# Altium schematic sheet ISEGYE_IDOL.SchDoc
size A4
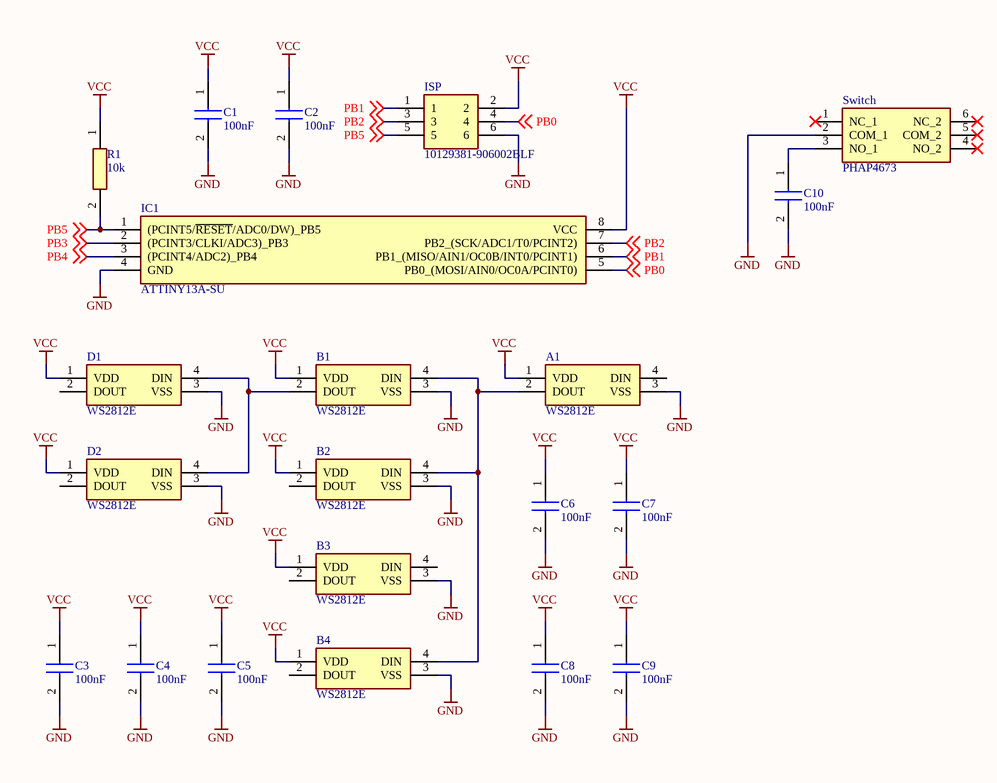
[diagram p0: ISEGYE_IDOL.SchDoc]

## Parts
A1  WS2812E  [WS2812E]
B1  WS2812E  [WS2812E]
B2  WS2812E  [WS2812E]
B3  WS2812E  [WS2812E]
B4  WS2812E  [WS2812E]
C1  100nF  [CAPC2012X94N]
C2  100nF  [CAPC2012X94N]
C3  100nF  [CAPC2012X94N]
C4  100nF  [CAPC2012X94N]
C5  100nF  [CAPC2012X94N]
C6  100nF  [CAPC2012X94N]
C7  100nF  [CAPC2012X94N]
C8  100nF  [CAPC2012X94N]
C9  100nF  [CAPC2012X94N]
C10  100nF  [CAPC2012X94N]
D1  WS2812E  [WS2812E]
D2  WS2812E  [WS2812E]
IC1  ATTINY13A-SU  [SOIC127P798X216-8N]
ISP  10129381-906002BLF  [HDRV6W67P254_2X3_762X483X858P]
R1  10k  [RESC2012X65N]
Switch  PHAP4673  [PHAP4673]

## Nets
GND: A1.3(VSS) B1.3(VSS) B2.3(VSS) B3.3(VSS) B4.3(VSS) C1.2 C2.2 C3.2 C4.2 C5.2 C6.2 C7.2 C8.2 C9.2 C10.2 D1.3(VSS) D2.3(VSS) IC1.4(GND) ISP.6 Switch.2(COM_1)
VCC: A1.1(VDD) B1.1(VDD) B2.1(VDD) B3.1(VDD) B4.1(VDD) C1.1 C2.1 C3.1 C4.1 C5.1 C6.1 C7.1 C8.1 C9.1 D1.1(VDD) D2.1(VDD) IC1.8(VCC) ISP.2 R1.1
PB0: IC1.5(PB0_(MOSI/AIN0/OC0A/PCINT0)) ISP.4 ; off-sheet PB0
PB1: IC1.6(PB1_(MISO/AIN1/OC0B/INT0/PCINT1)) ISP.1 ; off-sheet PB1
PB2: IC1.7(PB2_(SCK/ADC1/T0/PCINT2)) ISP.3 ; off-sheet PB2
PB3: IC1.2((PCINT3/CLKI/ADC3)_PB3) ; off-sheet PB3
PB4: IC1.3((PCINT4/ADC2)_PB4) ; off-sheet PB4
PB5: IC1.1((PCINT5/~{RESET}/ADC0/DW)_PB5) ISP.5 R1.2 ; off-sheet PB5
NetA1_2: A1.2(DOUT) B1.4(DIN) B2.4(DIN) B4.4(DIN)
NetB1_2: B1.2(DOUT) D1.4(DIN) D2.4(DIN)
NetC10_1: C10.1 Switch.3(NO_1)

Not connected (* = marked no-connect by the designer): A1 4(DIN); B2 2(DOUT); B3 2(DOUT) 4(DIN); B4 2(DOUT); D1 2(DOUT); D2 2(DOUT); Switch 1(NC_1)* 4(NO_2)* 5(COM_2)* 6(NC_2)*

## Library data of the parts
A1 B1-B4 D1 D2 = WS2812E: LED; Manufacturer_Name: Worldsemi; Datasheet Link: https://datasheet.lcsc.com/szlcsc/1811151230_Worldsemi-WS2812E_C139127.pdf; Height: 1.62mm; Manufacturer_Part_Number: WS2812E
C1-C10 = 08055A130JAT2A: Capacitor; Manufacturer_Name: AVX; Datasheet Link: https://componentsearchengine.com/Datasheets/1/06031A100FAT2A.pdf; Height: 0.94mm; Manufacturer_Part_Number: 08055A130JAT2A; Mouser Part Number: 581-08055A130JAT2A; Mouser Price/Stock: https://www.mouser.com/Search/Refine.aspx?Keyword=581-08055A130JAT2A
IC1 = ATTINY13A-SU: Integrated Circuit; Manufacturer_Name: Microchip; Datasheet Link: https://datasheet.datasheetarchive.com/originals/distributors/Datasheets_SAMA/7ccf11fd65263fe885f8a17906f42386.pdf; Height: 2.16mm; Manufacturer_Part_Number: ATTINY13A-SU; Mouser Part Number: 556-ATTINY13A-SU; Mouser Price/Stock: https://www.mouser.co.uk/ProductDetail/Microchip-Technology-Atmel/ATTINY13A-SU?qs=K8BHR703ZXihkof3R2k%2FGw%3D%3D; Arrow Part Number: ATTINY13A-SU; Arrow Price/Stock: https://www.arrow.com/en/products/attiny13a-su/microchip-technology?region=nac
ISP = 10129381-906002BLF: Connector; Manufacturer_Name: Amphenol; Datasheet Link: https://componentsearchengine.com/Datasheets/1/10129381-906002BLF.pdf; Height: 8.58mm; Manufacturer_Part_Number: 10129381-906002BLF; Mouser Part Number: 649-1012938190602BLF; Mouser Price/Stock: https://www.mouser.co.uk/ProductDetail/Amphenol-FCI/10129381-906002BLF?qs=DXv0QSHKF4zSKXKyBbBVMw%3D%3D; Arrow Part Number: 10129381-906002BLF; Arrow Price/Stock: https://www.arrow.com/en/products/10129381-906002blf/amphenol-fci?region=europe
R1 = NTR10B1002CTRF: Resistor; Manufacturer_Name: NIC Components; Datasheet Link: https://docs.rs-online.com/d130/0900766b810b8778.pdf; Height: 0.65mm; Manufacturer_Part_Number: NTR10B1002CTRF; Arrow Part Number: NTR10B1002CTRF; Arrow Price/Stock: https://www.arrow.com/en/products/ntr10b1002ctrf/nic-components
Switch = PHAP4673: Switch; Manufacturer_Name: Apem; Datasheet Link: https://www.apem.com/int/index.php?controller=attachment&id_attachment=804; Height: 12.5mm; Manufacturer_Part_Number: PHAP4673; Mouser Part Number: 642-PHAP4673; Mouser Price/Stock: https://www.mouser.co.uk/ProductDetail/Apem/PHAP4673?qs=6hR9CYnVCPA0g5B2mhE3jw%3D%3D